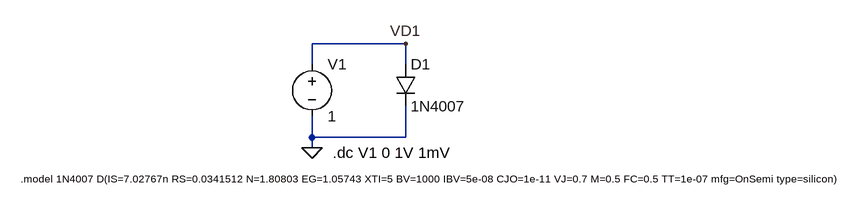
[diagram p0: schematic E6-Curva-1N4007.asc]
E6-Curva-1N4007.asc, the LTspice schematic file:
Version 4
SHEET 1 1260 680
WIRE -448 48 -592 48
WIRE -592 80 -592 48
WIRE -448 80 -448 48
WIRE -592 192 -592 160
WIRE -448 192 -448 144
WIRE -448 192 -592 192
WIRE -592 208 -592 192
FLAG -592 208 0
FLAG -448 48 VD1
SYMBOL diode -464 80 R0
SYMATTR InstName D1
SYMATTR Value 1N4007
SYMBOL voltage -592 64 R0
SYMATTR InstName V1
SYMATTR Value 1
TEXT -1040 256 Left 1 !.model 1N4007 D(IS=7.02767n RS=0.0341512 N=1.80803 EG=1.05743 XTI=5 BV=1000 IBV=5e-08 CJO=1e-11 VJ=0.7 M=0.5 FC=0.5 TT=1e-07 mfg=OnSemi type=silicon)
TEXT -560 216 Left 2 !.dc V1 0 1V 1mV

The netlist it stands for:
* E6-Curva-1N4007.asc
D1 VD1 0 1N4007
V1 VD1 0 1
.model D D
.lib standard.dio
.model 1N4007 D(IS=7.02767n RS=0.0341512 N=1.80803 EG=1.05743 XTI=5 BV=1000 IBV=5e-08 CJO=1e-11 VJ=0.7 M=0.5 FC=0.5 TT=1e-07 mfg=OnSemi type=silicon)
.dc V1 0 1V 1mV
.backanno
.end